# EAGLE design S7DG2_MCU_only_edge_Power_SPI (EAGLE 9.6.2)
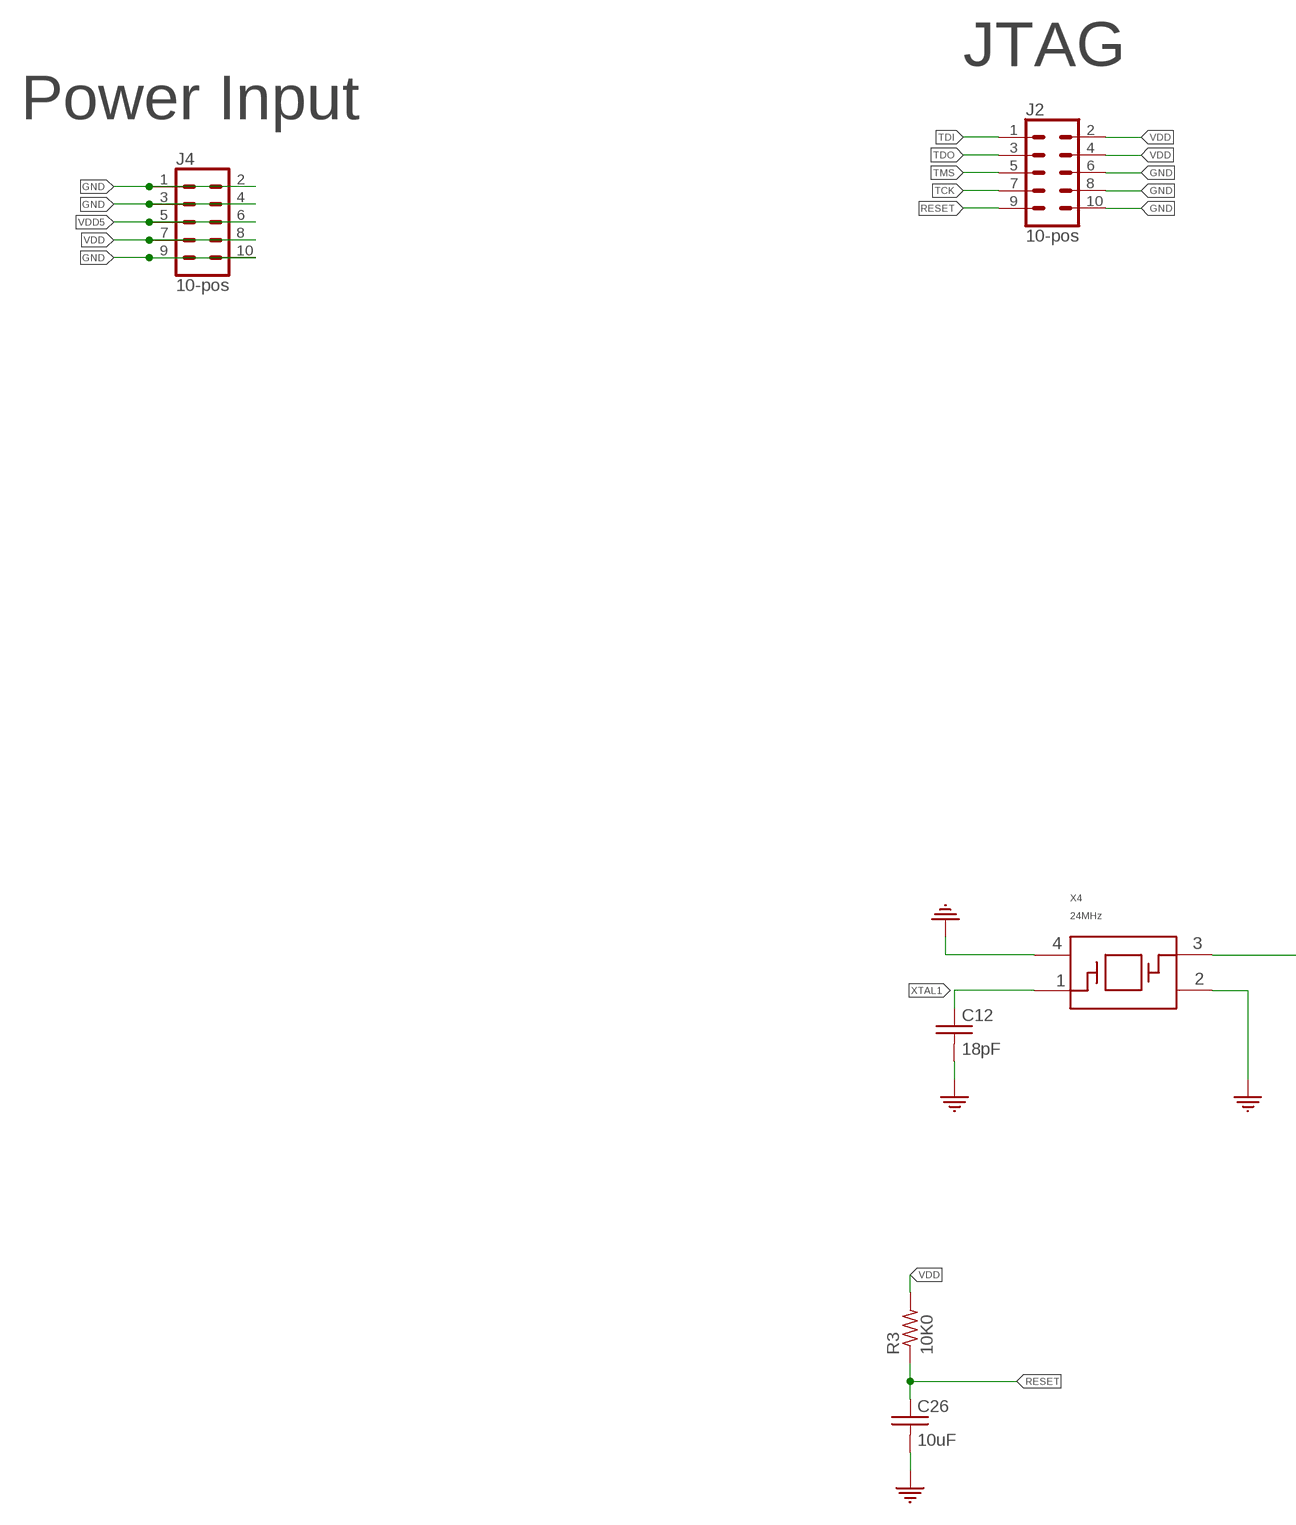
[diagram p0: schematic, sheet 1, part 1 of 2]
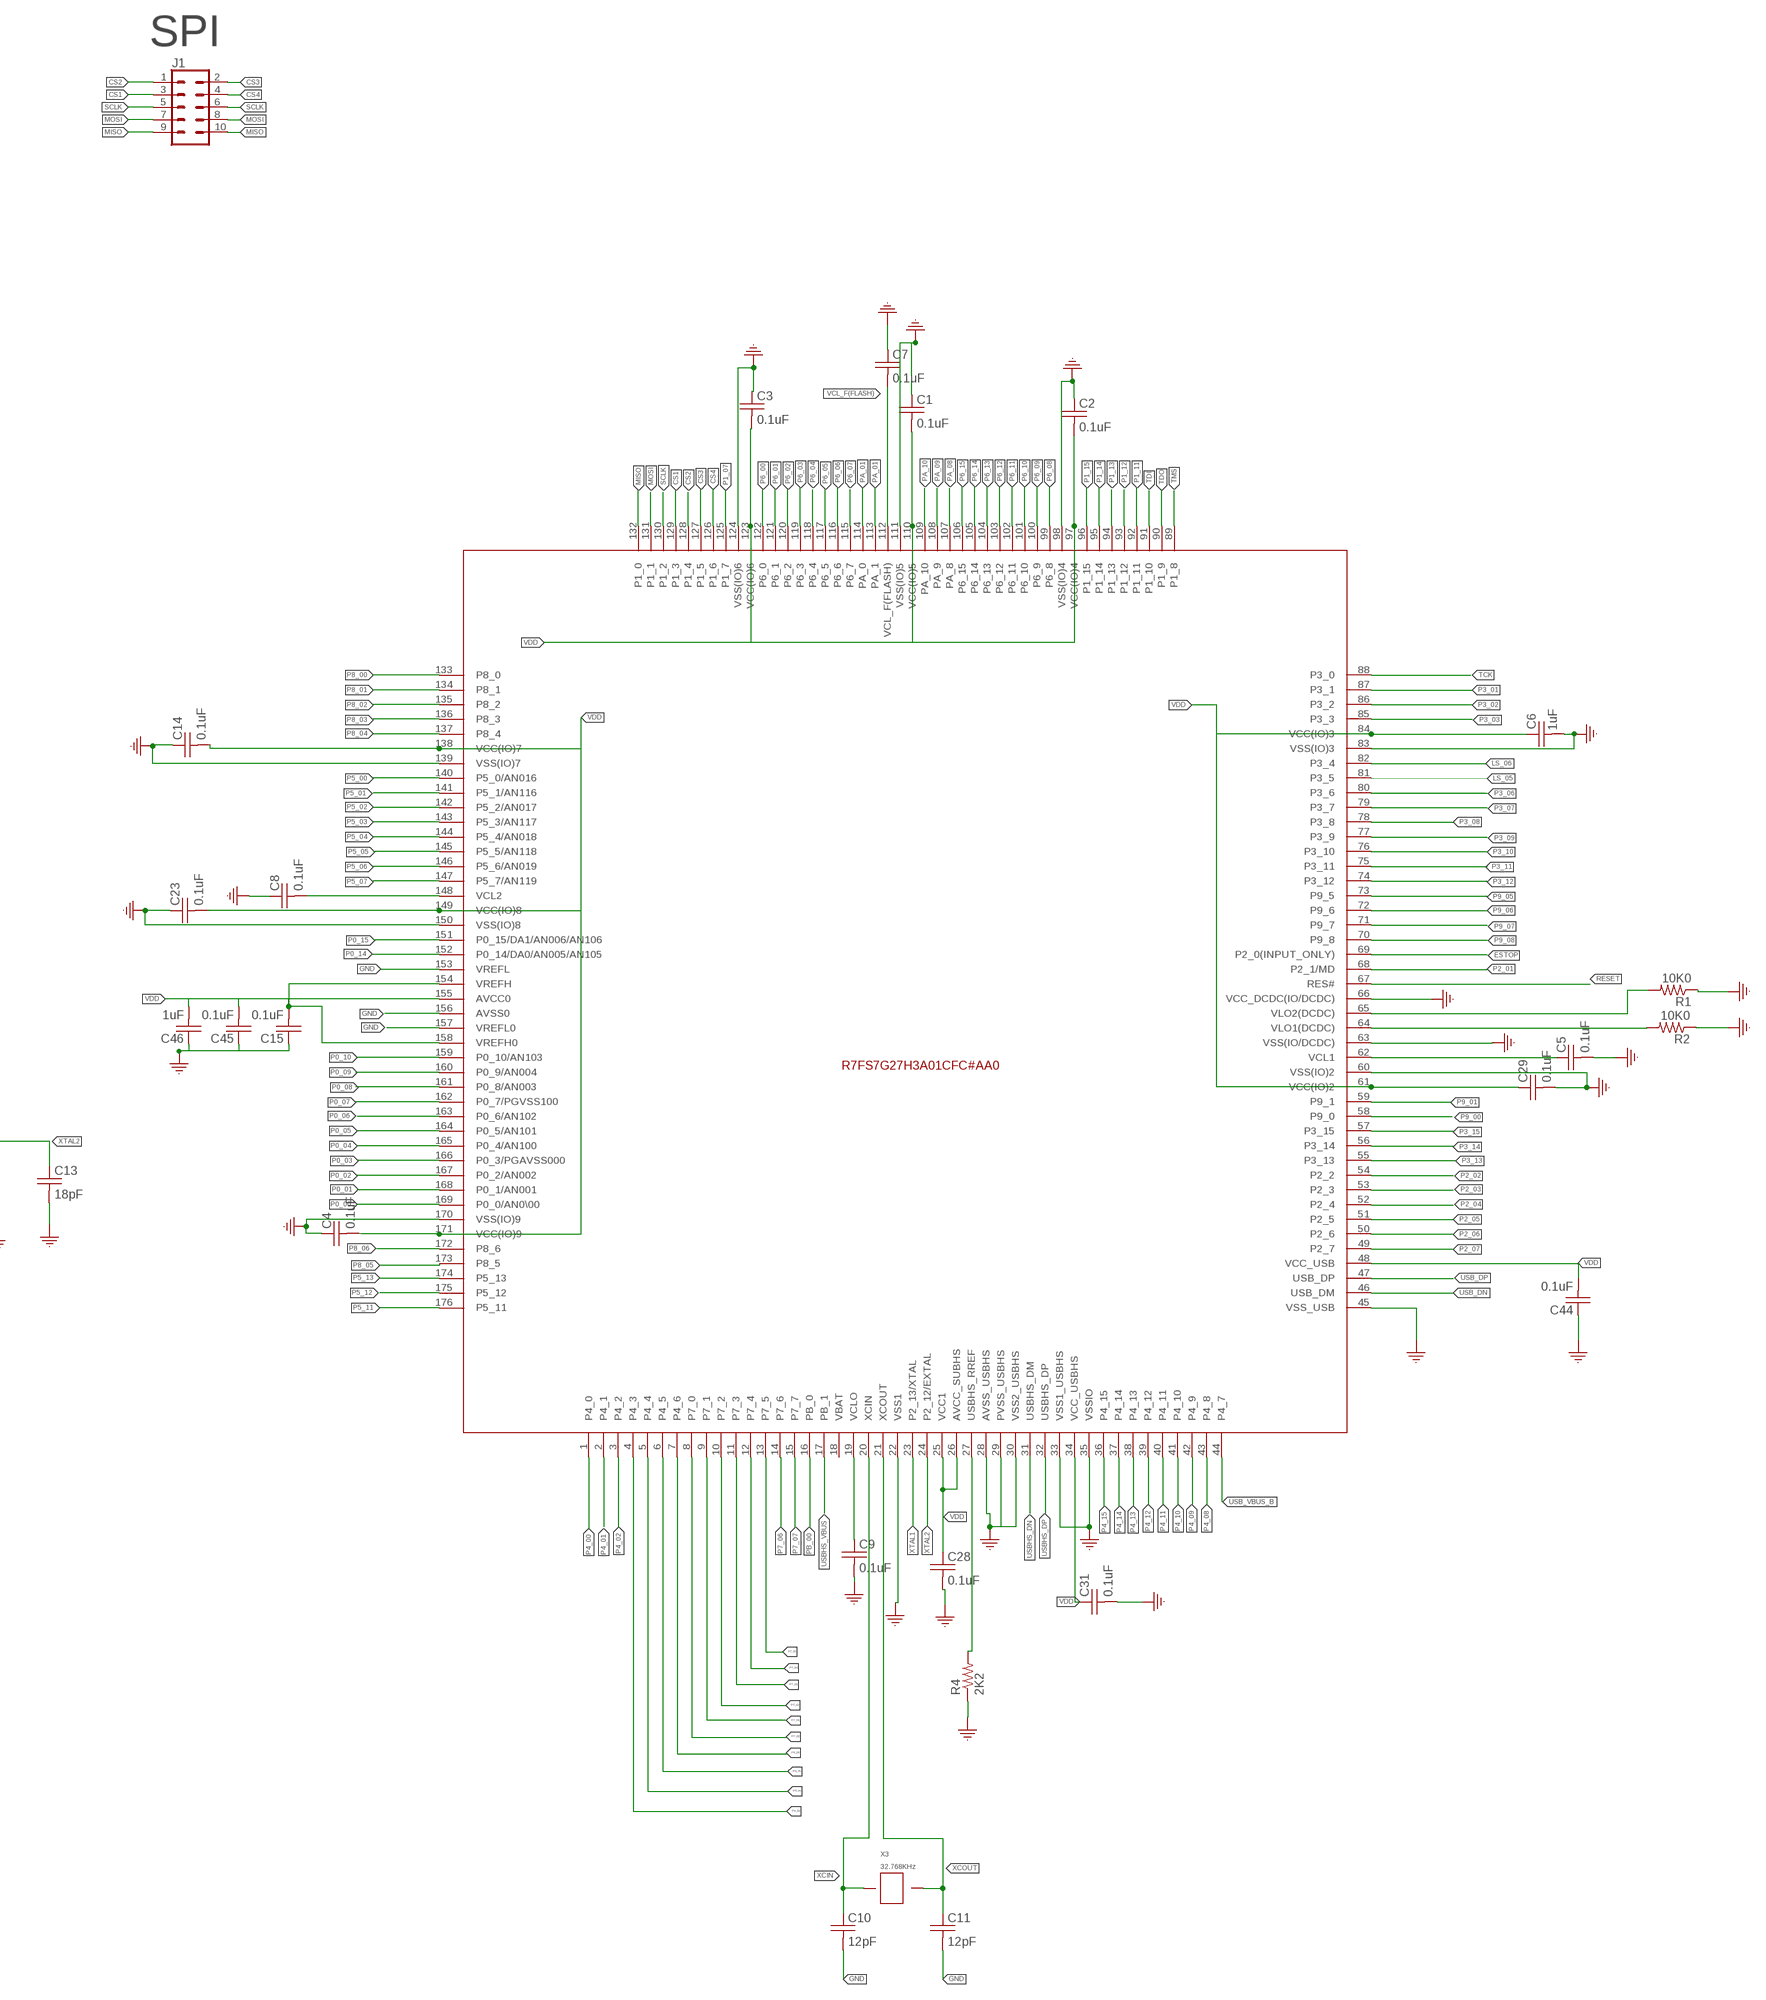
[diagram p1: schematic, sheet 1, part 2 of 2]

## Parts
C1  0.1uF  C_0402_0.1UF  [0402]
C2  0.1uF  C_0402_0.1UF  [0402]
C3  0.1uF  C_0402_0.1UF  [0402]
C4  0.1uF  C_0402_0.1UF  [0402]
C5  0.1uF  C_0402_0.1UF  [0402]
C6  1uF  C_0402_1UF  [0402]
C7  0.1uF  C_0402_0.1UF  [0402]
C8  0.1uF  C_0402_0.1UF  [0402]
C9  0.1uF  C_0402_0.1UF  [0402]
C10  12pF  C_0402_12PF  [0402]
C11  12pF  C_0402_12PF  [0402]
C12  18pF  C_0402_18PF  [0402]
C13  18pF  C_0402_18PF  [0402]
C14  0.1uF  C_0402_0.1UF  [0402]
C15  0.1uF  C_0402_0.1UF  [0402]
C23  0.1uF  C_0402_0.1UF  [0402]
C26  10uF  C_0402_10UF  [0402]
C28  0.1uF  C_0402_0.1UF  [0402]
C29  0.1uF  C_0402_0.1UF  [0402]
C31  0.1uF  C_0402_0.1UF  [0402]
C44  0.1uF  C_0402_0.1UF  [0402]
C45  0.1uF  C_0402_0.1UF  [0402]
C46  1uF  C_0402_1UF  [0402]
J1  CONN_05X2PTH  [2X5]
J2  10-pos  CONN_05X2_RAPTH  [2X5]
J4  10-pos  CONN_05X2_RAPTH  [2X5]
R1  10K0  R_0402_10K0  [0402]
R2  10K0  R_0402_10K0  [0402]
R3  10K0  R_0402_10K0  [0402]
R4  2K2  R_0402_2K2  [0402]
U2  S7G2LQFP176  RENESAS_S7G2_X_176  [LQFP176_24X24]
X3  32.768KHz  XTAL_32.768KHZ  [SMD_X_2_PADS]
X4  24MHz  XTAL_24_MHZ  [SMD_3225]

## Nets
CS1: J1.3 U2.129(P1_3)
CS2: J1.1 U2.128(P1_4)
CS3: J1.2 U2.127(P1_5)
CS4: J1.4 U2.126(P1_6)
ESTOP: U2.69(P2_0(INPUT_ONLY))
GND: C1.P$1 C2.P$1 C3.P$1 C4.P$1 C5.P$2 C6.P$2 C7.P$1 C8.P$1 C9.P$2 C10.P$2 C11.P$2 C12.P$2 C13.P$2 C14.P$1 C15.P$1 C23.P$1 C26.P$2 C28.P$2 C29.P$2 C31.P$2 C44.P$1 C45.P$1 C46.P$1 J2.6 J2.8 J2.10 J4.1 J4.2 J4.3 J4.4 J4.9 J4.10 R1.P$1 R2.P$1 R4.P$1 U2.22(VSS1) U2.28(AVSS_USBHS) U2.29(PVSS_USBHS) U2.30(VSS2_USBHS) U2.33(VSS1_USBHS) U2.35(VSSIO) U2.45(VSS_USB) U2.60(VSS(IO)2) U2.63(VSS(IO/DCDC)) U2.66(VCC_DCDC(IO/DCDC)) U2.83(VSS(IO)3) U2.98(VSS(IO)4) U2.111(VSS(IO)5) U2.124(VSS(IO)6) U2.139(VSS(IO)7) U2.150(VSS(IO)8) U2.153(VREFL) U2.156(AVSS0) U2.157(VREFL0) U2.170(VSS(IO)9) X4.2 X4.4
LS_05: U2.81(P3_5)
LS_06: U2.82(P3_4)
MISO: J1.9 J1.10 U2.132(P1_0)
MOSI: J1.7 J1.8 U2.131(P1_1)
N$2: C8.P$2 U2.148(VCL2)
N$3: C9.P$1 U2.19(VCLO)
N$9: C5.P$1 U2.62(VCL1)
N$10: R2.P$2 U2.64(VLO1(DCDC))
N$11: R1.P$2 U2.65(VLO2(DCDC))
N$12: R4.P$2 U2.27(USBHS_RREF)
P0_00: U2.169(P0_0/AN0\00)
P0_01: U2.168(P0_1/AN001)
P0_02: U2.167(P0_2/AN002)
P0_03: U2.166(P0_3/PGAVSS000)
P0_04: U2.165(P0_4/AN100)
P0_05: U2.164(P0_5/AN101)
P0_06: U2.163(P0_6/AN102)
P0_07: U2.162(P0_7/PGVSS100)
P0_08: U2.161(P0_8/AN003)
P0_09: U2.160(P0_9/AN004)
P0_10: U2.159(P0_10/AN103)
P0_14: U2.152(P0_14/DA0/AN005/AN105)
P0_15: U2.151(P0_15/DA1/AN006/AN106)
P1_07: U2.125(P1_7)
P1_11: U2.92(P1_11)
P1_12: U2.93(P1_12)
P1_13: U2.94(P1_13)
P1_14: U2.95(P1_14)
P1_15: U2.96(P1_15)
P2_01: U2.68(P2_1/MD)
P2_02: U2.54(P2_2)
P2_03: U2.53(P2_3)
P2_04: U2.52(P2_4)
P2_05: U2.51(P2_5)
P2_06: U2.50(P2_6)
P2_07: U2.49(P2_7)
P3_01: U2.87(P3_1)
P3_02: U2.86(P3_2)
P3_03: U2.85(P3_3)
P3_06: U2.80(P3_6)
P3_07: U2.79(P3_7)
P3_08: U2.78(P3_8)
P3_09: U2.77(P3_9)
P3_10: U2.76(P3_10)
P3_11: U2.75(P3_11)
P3_12: U2.74(P3_12)
P3_13: U2.55(P3_13)
P3_14: U2.56(P3_14)
P3_15: U2.57(P3_15)
P4_00: U2.1(P4_0)
P4_01: U2.2(P4_1)
P4_02: U2.3(P4_2)
P4_03: U2.4(P4_3)
P4_04: U2.5(P4_4)
P4_05: U2.6(P4_5)
P4_06: U2.7(P4_6)
P4_08: U2.43(P4_8)
P4_09: U2.42(P4_9)
P4_10: U2.41(P4_10)
P4_11: U2.40(P4_11)
P4_12: U2.39(P4_12)
P4_13: U2.38(P4_13)
P4_14: U2.37(P4_14)
P4_15: U2.36(P4_15)
P5_00: U2.140(P5_0/AN016)
P5_01: U2.141(P5_1/AN116)
P5_02: U2.142(P5_2/AN017)
P5_03: U2.143(P5_3/AN117)
P5_04: U2.144(P5_4/AN018)
P5_05: U2.145(P5_5/AN118)
P5_06: U2.146(P5_6/AN019)
P5_07: U2.147(P5_7/AN119)
P5_11: U2.176(P5_11)
P5_12: U2.175(P5_12)
P5_13: U2.174(P5_13)
P6_00: U2.122(P6_0)
P6_01: U2.121(P6_1)
P6_02: U2.120(P6_2)
P6_03: U2.119(P6_3)
P6_04: U2.118(P6_4)
P6_05: U2.117(P6_5)
P6_06: U2.116(P6_6)
P6_07: U2.115(P6_7)
P6_08: U2.99(P6_8)
P6_09: U2.100(P6_9)
P6_10: U2.101(P6_10)
P6_11: U2.102(P6_11)
P6_12: U2.103(P6_12)
P6_13: U2.104(P6_13)
P6_14: U2.105(P6_14)
P6_15: U2.106(P6_15)
P7_00: U2.8(P7_0)
P7_01: U2.9(P7_1)
P7_02: U2.10(P7_2)
P7_03: U2.11(P7_3)
P7_04: U2.12(P7_4)
P7_05: U2.13(P7_5)
P7_06: U2.14(P7_6)
P7_07: U2.15(P7_7)
P8_00: U2.133(P8_0)
P8_01: U2.134(P8_1)
P8_02: U2.135(P8_2)
P8_03: U2.136(P8_3)
P8_04: U2.137(P8_4)
P8_05: U2.173(P8_5)
P8_06: U2.172(P8_6)
P9_00: U2.58(P9_0)
P9_01: U2.59(P9_1)
P9_05: U2.73(P9_5)
P9_06: U2.72(P9_6)
P9_07: U2.71(P9_7)
P9_08: U2.70(P9_8)
PA_01: U2.113(PA_1) U2.114(PA_0)
PA_08: U2.107(PA_8)
PA_09: U2.108(PA_9)
PA_10: U2.109(PA_10)
PB_00: U2.16(PB_0)
RESET: C26.P$1 J2.9 R3.P$1 U2.67(RES#)
SCLK: J1.5 J1.6 U2.130(P1_2)
TCK: J2.7 U2.88(P3_0)
TDI: J2.1 U2.91(P1_10)
TDO: J2.3 U2.90(P1_9)
TMS: J2.5 U2.89(P1_8)
USB_DN [USB_DIFF_PAIR]: U2.46(USB_DM)
USB_DP [USB_DIFF_PAIR]: U2.47(USB_DP)
USB_VBUS_B: U2.44(P4_7)
USBHS_DN: U2.31(USBHS_DM)
USBHS_DP: U2.32(USBHS_DP)
USBHS_VBUS: U2.17(PB_1)
VCL_F(FLASH): C7.P$2 U2.112(VCL_F(FLASH))
VDD: C1.P$2 C2.P$2 C3.P$2 C4.P$2 C6.P$1 C14.P$2 C15.P$2 C23.P$2 C28.P$1 C29.P$1 C31.P$1 C44.P$2 C45.P$2 C46.P$2 J2.2 J2.4 J4.7 J4.8 R3.P$2 U2.25(VCC1) U2.26(AVCC_SUBHS) U2.34(VCC_USBHS) U2.48(VCC_USB) U2.61(VCC(IO)2) U2.84(VCC(IO)3) U2.97(VCC(IO)4) U2.110(VCC(IO)5) U2.123(VCC(IO)6) U2.138(VCC(IO)7) U2.149(VCC(IO)8) U2.154(VREFH) U2.155(AVCC0) U2.158(VREFH0) U2.171(VCC(IO)9)
VDD5: J4.5 J4.6
XCIN: C10.P$1 U2.20(XCIN) X3.P$1
XCOUT: C11.P$1 U2.21(XCOUT) X3.P$2
XTAL1: C12.P$1 U2.23(P2_13/XTAL) X4.1
XTAL2: C13.P$1 U2.24(P2_12/EXTAL) X4.3
Unconnected: U2.18(VBAT)

## Notes on the sheet
- SPI
- JTAG
- Power Input

## Library data of the parts
C1-C5 C7-C9 C14 C15 C23 C28 C29 C31 C44 C45 = 3D_MIG_Controller:C_0402_0.1UF; PARTNO: CL05F104ZO5NNNC
C6 C46 = 3D_MIG_Controller:C_0402_1UF; PARTNO: CL05A105KO5NNNC
C10 C11 = 3D_MIG_Controller:C_0402_12PF; PARTNO: CL05C120JB5NNNC
C12 C13 = 3D_MIG_Controller:C_0402_18PF; PARTNO: UMK105CG180JV-F
C26 = 3D_MIG_Controller:C_0402_10UF; PARTNO: CL05A106MP8NUB8
J1 = 3D_MIG_Controller:CONN_05X2: Multi connection point. Often used as Generic Header-pin footprint for 0.1 inch spaced/style header connections For AVR SPI programming port, see special device with nice symbol: "AVR_SPI_PROG_5x2.dev" You can populate with any combo of single row headers, but if you'd like an exact match, check these: 2x5 AVR ICSP Male Header <https://www.sparkfun.com/products/778> (PRT-00778) 2x5 Pin Shrouded Header <https://www.sparkfun.com/products/8506> (PRT-08506) On any of the 0.1 inch spaced packages, you can populate with these: Break Away Headers - Straight <https://www.sparkfun.com/products/116> (PRT-00116) Break Away Male Headers - Right Angle <https://www.sparkfun.com/products/553> (PRT-00553) Female Headers <https://www.sparkfun.com/products/115> (PRT-00115) Break Away Headers - Machine Pin <https://www.sparkfun.com/products/117> (PRT-00117) Break Away Female Headers - Swiss Machine Pin <https://www.sparkfun.com/products/743> (PRT-00743) Special note: the shrouded connector mates well with our 5x2 ribbon cables: 2x5 Pin IDC Ribbon Cable <https://www.sparkfun.com/products/8535> (PRT-08535); PROD_ID: CONN-08499; SF_ID: PRT-0778
J2 J4 = 3D_MIG_Controller:CONN_05X2_RA: Connector Header Through Hole, Right Angle 10 position 0.100" (2.54mm); PARTNO: PH2RA-10-UA
R1-R3 = 3D_MIG_Controller:R_0402_10K0; PARTNO: RMCF0402JT10K0
R4 = 3D_MIG_Controller:R_0402_2K2; PARTNO: RMCF0402JT2K20
U2 = 3D_MIG_Controller:RENESAS_S7G2_X_176; PARTNO: R7FS7G27H3A01CFC#AA0
X3 = 3D_MIG_Controller:XTAL_32.768KHZ; PARTNO: ABS07-32.768KHZ-T
X4 = 3D_MIG_Controller:XTAL_24_MHZ; PARTNO: FA-238 24.0000MB-C3

## Board
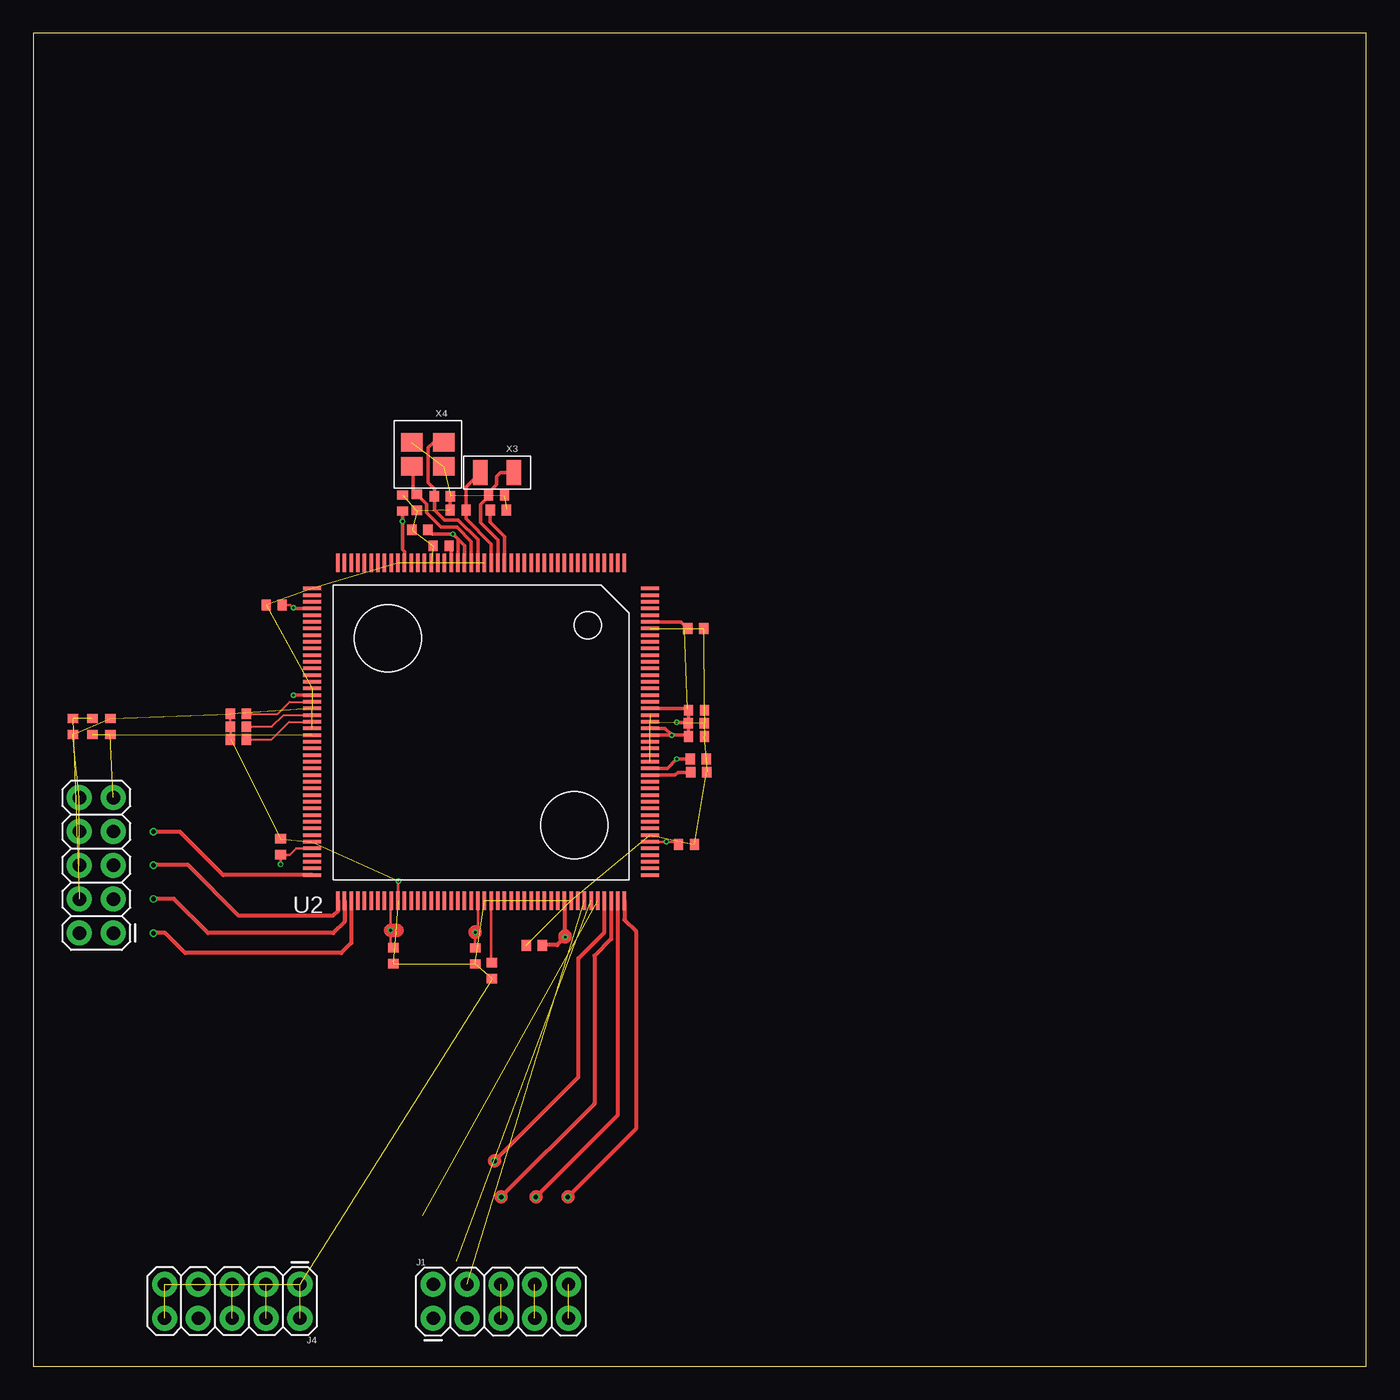
[diagram p2: board, top side]
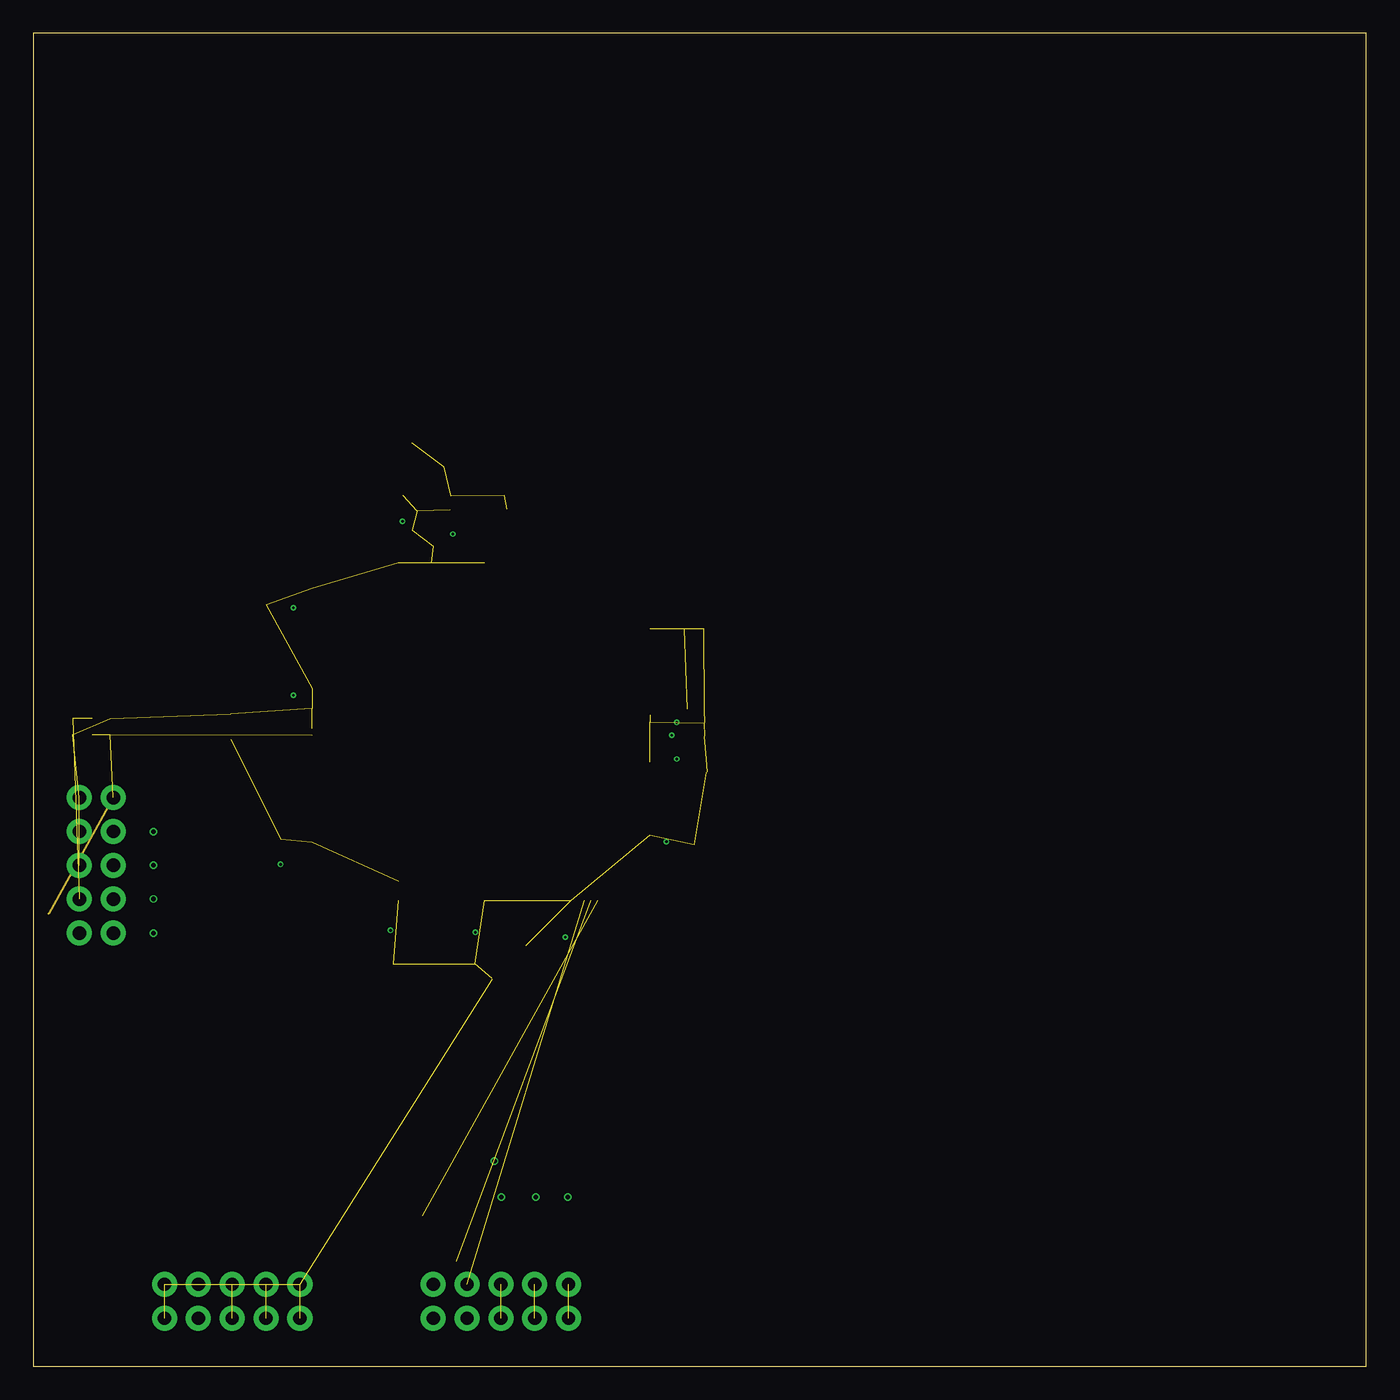
[diagram p3: board, inner layer Route3]
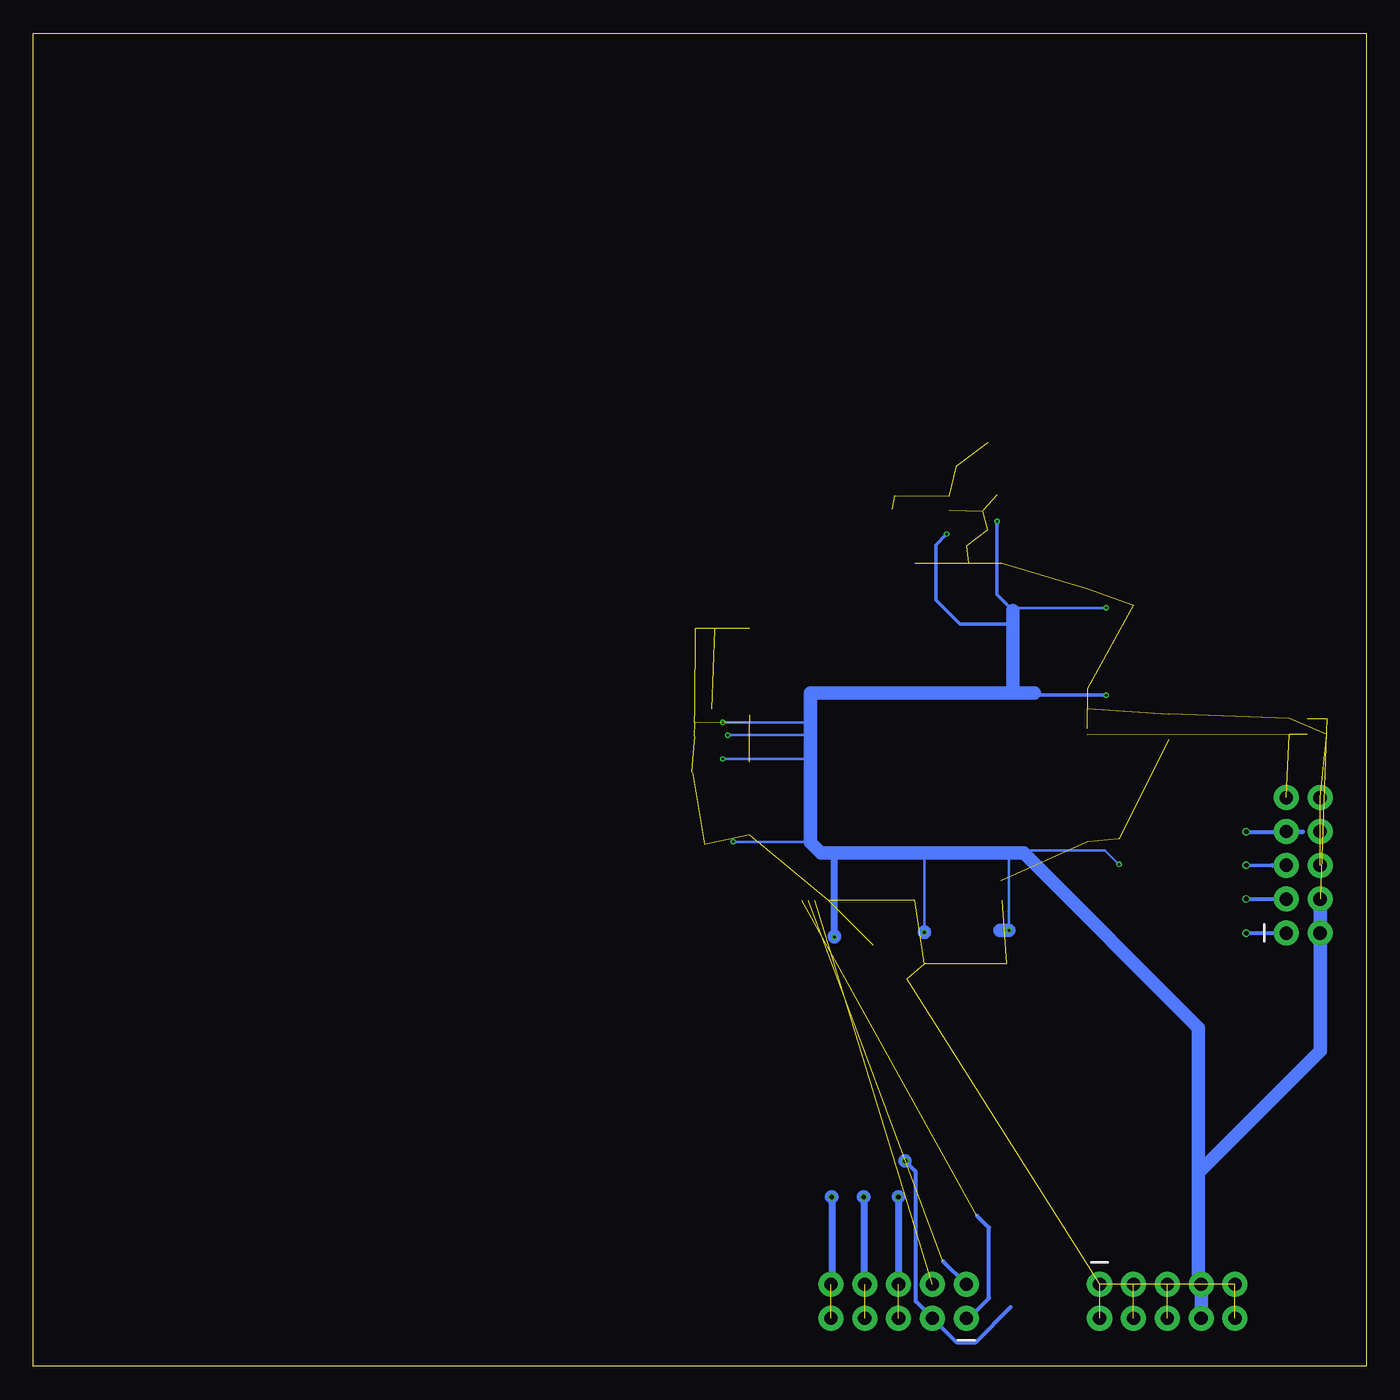
[diagram p4: board, bottom side, seen from below]

Size 100 x 100 mm. Coordinates in mm from the lower left corner, seen from the top.
Outline: 0,0 100,0 100,100 0,100 0,0
Copper layers (1*16): Top 0.035mm / dielectric 1.5mm / Bottom 0.035mm
Design rules "default": minimum track width 6mil, minimum drill 0.2mm, track to track 6mil, track to pad 6mil, pad to pad 6mil, via to via 6mil, smd to smd 6mil, copper to edge 40mil, drill to drill 6mil, minimum pad ring 10mil, minimum via ring 4mil, stop-mask expansion 4mil, vias tented up to drill 0mil, thermal gap 10mil

### Footprints (pad centres in the part's own frame; a part is rotated, then mirrored left to right if it is on the bottom)
0402 = smd 0.8 x 0.7: P$1 0,0.6; P$2 0,-0.6
2X5 = drill 1 pad 1.88: 1 0,0; 2 0,2.54; 3 2.54,0; 4 2.54,2.54; 5 5.08,0; 6 5.08,2.54; 7 7.62,0; 8 7.62,2.54; 9 10.16,0; 10 10.16,2.54
LQFP176_24X24 = smd 1.372 x 0.254: 1 -12.675,10.75; 2 -12.675,10.25; 3 -12.675,9.75; 4 -12.675,9.25; 5 -12.675,8.75; 6 -12.675,8.25; 7 -12.675,7.75; 8 -12.675,7.25; 9 -12.675,6.75; 10 -12.675,6.25; 11 -12.675,5.75; 12 -12.675,5.25; 13 -12.675,4.75; 14 -12.675,4.25; 15 -12.675,3.75; 16 -12.675,3.25; 17 -12.675,2.75; 18 -12.675,2.25; 19 -12.675,1.75; 20 -12.675,1.25; 21 -12.675,0.75; 22 -12.675,0.25; 23 -12.675,-0.25; 24 -12.675,-0.75; 25 -12.675,-1.25; 26 -12.675,-1.75; 27 -12.675,-2.25; 28 -12.675,-2.75; 29 -12.675,-3.25; 30 -12.675,-3.75; 31 -12.675,-4.25; 32 -12.675,-4.75; 33 -12.675,-5.25; 34 -12.675,-5.75; 35 -12.675,-6.25; 36 -12.675,-6.75; 37 -12.675,-7.25; 38 -12.675,-7.75; 39 -12.675,-8.25; 40 -12.675,-8.75; 41 -12.675,-9.25; 42 -12.675,-9.75; 43 -12.675,-10.25; 44 -12.675,-10.75; 89 12.675,-10.75; 90 12.675,-10.25; 91 12.675,-9.75; 92 12.675,-9.25; 93 12.675,-8.75; 94 12.675,-8.25; 95 12.675,-7.75; 96 12.675,-7.25; 97 12.675,-6.75; 98 12.675,-6.25; 99 12.675,-5.75; 100 12.675,-5.25; 101 12.675,-4.75; 102 12.675,-4.25; 103 12.675,-3.75; 104 12.675,-3.25; 105 12.675,-2.75; 106 12.675,-2.25; 107 12.675,-1.75; 108 12.675,-1.25; 109 12.675,-0.75; 110 12.675,-0.25; 111 12.675,0.25; 112 12.675,0.75; 113 12.675,1.25; 114 12.675,1.75; 115 12.675,2.25; 116 12.675,2.75; 117 12.675,3.25; 118 12.675,3.75; 119 12.675,4.25; 120 12.675,4.75; 121 12.675,5.25; 122 12.675,5.75; 123 12.675,6.25; 124 12.675,6.75; 125 12.675,7.25; 126 12.675,7.75; 127 12.675,8.25; 128 12.675,8.75; 129 12.675,9.25; 130 12.675,9.75; 131 12.675,10.25; 132 12.675,10.75 | smd 0.254 x 1.372: 45 -10.75,-12.675; 46 -10.25,-12.675; 47 -9.75,-12.675; 48 -9.25,-12.675; 49 -8.75,-12.675; 50 -8.25,-12.675; 51 -7.75,-12.675; 52 -7.25,-12.675; 53 -6.75,-12.675; 54 -6.25,-12.675; 55 -5.75,-12.675; 56 -5.25,-12.675; 57 -4.75,-12.675; 58 -4.25,-12.675; 59 -3.75,-12.675; 60 -3.25,-12.675; 61 -2.75,-12.675; 62 -2.25,-12.675; 63 -1.75,-12.675; 64 -1.25,-12.675; 65 -0.75,-12.675; 66 -0.25,-12.675; 67 0.25,-12.675; 68 0.75,-12.675; 69 1.25,-12.675; 70 1.75,-12.675; 71 2.25,-12.675; 72 2.75,-12.675; 73 3.25,-12.675; 74 3.75,-12.675; 75 4.25,-12.675; 76 4.75,-12.675; 77 5.25,-12.675; 78 5.75,-12.675; 79 6.25,-12.675; 80 6.75,-12.675; 81 7.25,-12.675; 82 7.75,-12.675; 83 8.25,-12.675; 84 8.75,-12.675; 85 9.25,-12.675; 86 9.75,-12.675; 87 10.25,-12.675; 88 10.75,-12.675; 133 10.75,12.675; 134 10.25,12.675; 135 9.75,12.675; 136 9.25,12.675; 137 8.75,12.675; 138 8.25,12.675; 139 7.75,12.675; 140 7.25,12.675; 141 6.75,12.675; 142 6.25,12.675; 143 5.75,12.675; 144 5.25,12.675; 145 4.75,12.675; 146 4.25,12.675; 147 3.75,12.675; 148 3.25,12.675; 149 2.75,12.675; 150 2.25,12.675; 151 1.75,12.675; 152 1.25,12.675; 153 0.75,12.675; 154 0.25,12.675; 155 -0.25,12.675; 156 -0.75,12.675; 157 -1.25,12.675; 158 -1.75,12.675; 159 -2.25,12.675; 160 -2.75,12.675; 161 -3.25,12.675; 162 -3.75,12.675; 163 -4.25,12.675; 164 -4.75,12.675; 165 -5.25,12.675; 166 -5.75,12.675; 167 -6.25,12.675; 168 -6.75,12.675; 169 -7.25,12.675; 170 -7.75,12.675; 171 -8.25,12.675; 172 -8.75,12.675; 173 -9.25,12.675; 174 -9.75,12.675; 175 -10.25,12.675; 176 -10.75,12.675
SMD_X_2_PADS = smd 1.9 x 1.1: P$1 0,1.25; P$2 0,-1.25
SMD_3225 = smd 1.6 x 1.4: 1 -1.2,-0.9; 2 1.2,-0.9; 3 1.2,0.9; 4 -1.2,0.9

### Placement (x,y rotation side)
C1  33.15,30.78 180 top
C2  27.01,30.79 180 top
C3  37.58,31.57 90 top
C4  49.71,55.35 270 top
C5  15.4,48.95 270 top
C6  18.56,38.96 180 top
C7  34.41,29.68 180 top
C8  49.92,44.56 270 top
C9  34.88,64.23 90 top
C10  34.76,65.33 90 top
C11  31.87,64.23 270 top
C12  30.7,65.27 90 top
C13  28.77,64.8 0 top
C14  49.01,39.15 270 top
C15  49.76,49.22 270 top
C23  49.9,45.55 270 top
C26  5.78,48 180 top
C28  29.01,62.74 270 top
C29  2.96,48 0 top
C31  27.71,64.75 180 top
C44  18.06,57.11 90 top
C45  49.75,47.25 270 top
C46  49.74,48.25 270 top
J1  30,3.6 0 top
J2  6,32.5 90 top
J4  20,6.14 180 top
R1  15.39,47.02 90 top
R2  15.38,47.98 90 top
R3  4.43,48 180 top
R4  30.59,61.55 90 top
U2  33.6,47.6 270 top
X3  34.8,67.04 270 top
X4  29.59,68.41 180 top

### Tracks (layer width: path | path; a pad name or v marks a point on that pad's centre or on a via)
CS1  (via drill 0.35)
  Top 0.305: v34.6,15.4 40.9,21.7 40.9,30.6 42.85,32.55 U2.129
  Top 1.016: v34.6,15.4
  Bottom 0.305: 26.66,4.44 29.3,1.8 30.74,1.8 J1.3 33.8,4.86 33.8,14.6 v34.6,15.4
  Bottom 1.016: v34.6,15.4
CS2  (1 unrouted)
  Bottom 0.305: J1.1 29.8,3.6 28.3,5.1 28.3,10.4 29.2,11.3
CS3  (1 unrouted)
  Bottom 0.305: J1.2 31.74,7.88
CS4  (1 unrouted)
GND  (via drill 0.2 layers 1-2)  (53 unrouted)
  Top 0.2: C5.P$2 14.78,48.93 R2.P$1 R1.P$1 14.76,47 | C2.P$1 27.01,30.11 | U2.98 27.35,36.35 v27.4,36.4 | C7.P$1 34.45,29.04 | C1.P$1 | C8.P$1 50.57,44.6 | C45.P$1 50.4,47.3 | 50.39,48.3 C46.P$1 | U2.156 46.26,48.33 | C13.P$2 28.8,64.17 | X4.2 28.18,69.1 | 31.27,65.24 C12.P$2 | C9.P$2 35.55,64.3
  Top 0.254: C11.P$2 31.27,65.24
MISO  (via drill 0.35)  (1 unrouted)
  Top 0.305: U2.132 44.35,33.5 45.2,32.65 45.2,17.8 v40.1,12.7
  Top 1.016: v40.1,12.7
  Bottom 0.508: v40.1,12.7 40.1,6.2 J1.10
  Bottom 1.016: v40.1,12.7
MOSI  (via drill 0.35)  (1 unrouted)
  Top 0.305: v37.7,12.7 43.85,18.85 U2.131
  Top 1.016: v37.7,12.7
  Bottom 0.508: v37.7,12.7 37.7,6.22 J1.8
  Bottom 1.016: v37.7,12.7
N$2
  Top 0.254: U2.148 48.15,44.35 48.36,44.56 C8.P$2
N$3
  Top 0.254: C9.P$1 34.28,63.33 35.35,62.25 U2.19
N$9
  Top 0.15: C5.P$1 18.32,48.95 19.22,49.85 U2.62
N$10
  Top 0.15: R2.P$2 17.9,47.98 18.77,48.85 U2.64
N$11
  Top 0.15: R1.P$2 17.88,47.02 19.21,48.35 20.7,48.35
  Top 0.2: 20.7,48.35 U2.65
N$12
  Top 0.254: U2.27 31.35,61.39 R4.P$2
P1_12
  Top 0.15: U2.93
P3_10
  Top 0.15: U2.76
P5_05
  Top 0.2: U2.145
P6_03
  Top 0.15: U2.119 37.85,34.73
PA_01  (1 unrouted)
RESET  (3 unrouted)
  Route3 0.15: J2.9 1.14,33.94
SCLK  (via drill 0.35)  (1 unrouted)
  Top 0.305: U2.130 43.35,32.05 42.1,30.8 42.1,19.69 v35.11,12.7 v35.1,12.7
  Top 1.016: v35.1,12.7
  Bottom 0.508: v35.1,12.7 35.1,6.16 J1.6
  Bottom 1.016: v35.1,12.7
TCK  (via drill 0.35)
  Top 0.305: U2.88 14.25,36.85 11,40.1 v9,40.1
  Bottom 0.305: v9,40.1 4.72,40.1 J2.7
TDI  (via drill 0.35)
  Top 0.15: U2.91
  Top 0.305: U2.91 23.85,31.75 23.1,31 11.4,31 9.9,32.5 v9,32.5
  Bottom 0.305: v9,32.5 J2.1
TDO  (via drill 0.35)
  Top 0.305: U2.90 23.35,33.35 22.5,32.5 13.1,32.5 10.54,35.06 v9,35.06
  Bottom 0.305: v9,35.06 7.11,35.04 J2.3
TMS  (via drill 0.35)
  Top 0.305: U2.89 22.85,34.16 22.47,33.79 15.41,33.79 11.6,37.6 v9,37.6
  Bottom 0.305: v9,37.6 7.08,37.58 J2.5
VCL_F(FLASH)
  Top 0.2: U2.112 34.35,30.34 C7.P$2
VDD  (via drill 0.2)  (3 unrouted)
  Top 0.2: U2.149 46.3,44.87 | U2.84 19.73,38.85 19.23,38.35 18.57,38.35 C6.P$1 18.56,37.92 18.55,37.91 v18.55,37.65 | 33.37,34.91 U2.110 33.35,32.85 33.15,32.65 33.15,32.6 | U2.138 v47.5,39.35 48.41,39.35 C14.P$2 | C4.P$2 49.06,55.3 48.88,55.3 | 49.08,49.3 C15.P$2 | C44.P$2 19.29,57.11 v19.5,56.9 | C1.P$2 v33.15,32.55 | C2.P$2 26.8,31.6 v26.8,32.7 26.8,34.88 U2.97
  Top 0.254: U2.61 v19.5,50.35 | U2.26 31.85,62.07 v31.48,62.44 | 49.16,48.27 C15.P$2 49.03,49.35 U2.158 | 49.16,48.27 C46.P$2 C45.P$2 | C45.P$2 | U2.154 v47.9,47.35 | v47.9,47.35 49.05,47.35 C45.P$2 | U2.155 47.4,47.85 v47.9,47.35 | v48.27,48.3 49.13,48.3 49.16,48.27 | U2.149 47.57,44.85 v48.27,45.55 C23.P$2 | U2.48 19.55,56.85 v19.5,56.9 | v31.48,62.44 32.35,61.57 U2.25 | C28.P$1 29.92,62.44 v31.48,62.44 | C31.P$1 27.71,63.51 | 27.71,63.51 v27.7,63.4 | U2.34 27.85,61.11 27.71,61.25 27.71,63.51 | C4.P$2 48.61,55.85 U2.171
  Top 0.305: U2.123 39.9,34.88 39.9,32.3 | v39.9,32.2 39.3,31.6 38.2,31.6 C3.P$2
  Top 1.016: v26.8,32.7 27.3,32.7 | v33.15,32.55 33.15,32.6 | v39.9,32.2 39.9,32.3
  Bottom 0.2: v19.5,56.9 26.3,56.9 | v48.27,45.55 41.75,45.55 41.7,45.5 | v47.9,47.35 41.75,47.35 41.7,47.3 | v48.27,48.3 41.7,48.3 | v47.5,39.35 41.75,39.35 41.7,39.3 | 33.15,32.6 33.15,38.5 | v26.8,32.7 26.8,38.5 | v18.55,37.65 19.6,38.7 25.5,38.7 25.7,38.5
  Bottom 0.254: v19.5,50.35 24.75,50.35 24.9,50.5 | 26.3,56.9 26.5,56.7 27.7,57.9 v27.7,63.4 | v31.48,62.44 32.3,61.62 32.3,57.5 30.5,55.7 26.5,55.7
  Bottom 0.508: 39.9,32.3 39.9,38.5
  Bottom 1.016: 12.58,14.52 12.58,6.34 J4.7 J4.8 | 26.5,50.5 41.7,50.5 41.7,48.3 41.7,47.3 41.7,45.5 41.7,39.3 40.9,38.5 39.9,38.5 33.15,38.5 26.8,38.5 25.7,38.5 12.58,25.38 12.58,14.52 | 24.9,50.5 26.5,50.5 | 26.5,56.7 26.5,55.7 26.5,50.5 | J2.4 J2.2 3.46,23.64 12.58,14.52 | v26.8,32.7 27.5,32.7 | v33.15,32.55 33.15,32.6 | v39.9,32.2 39.9,32.3
VDD5  (1 unrouted)
XCIN
  Top 0.15: 34.16,65.53 34.16,65.5 C10.P$1 33.91,65.33
  Top 0.254: U2.20 34.86,61.99 33.55,63.29 33.55,64.65 34.16,65.25 34.16,65.5 | X3.P$1 35.07,67.04 34.76,66.73 34.76,66.13 34.16,65.53 C10.P$1
XCOUT
  Top 0.15: 33.45,66.95 X3.P$2
  Top 0.254: U2.21 34.35,61.7 32.47,63.58 C11.P$1 32.47,65.96 33.45,66.95
XTAL1
  Top 0.15: 29.61,68.9 29.66,68.94 | 30.1,65.3 C12.P$1 30.1,64.32 30.1,64.25 | 30.7,69.31 X4.1
  Top 0.254: U2.23 33.35,62 31.85,63.5 30.85,63.5 30.1,64.25 | 30.1,64.32 30.1,65.3 30.1,65.82 29.61,66.3 29.61,68.9 | 29.66,68.94 30.02,69.31 30.7,69.31
XTAL2
  Top 0.15: 32.85,60.3 U2.24 | 29.49,64.69 28.77,65.42
  Top 0.254: X4.3 28.5,67.4 28.5,65.68 28.77,65.42 C13.P$1 | 28.94,65.25 C13.P$1 | 32.85,60.3 32.85,61.88 31.78,62.95 30.6,62.95 29.49,64.06 29.49,64.69 28.78,65.4 C13.P$1